# Altium schematic sheet Pixracer_V1_FMU_Alternative_0.SchDoc
size 331 x 293 mm; Origin: Eagle
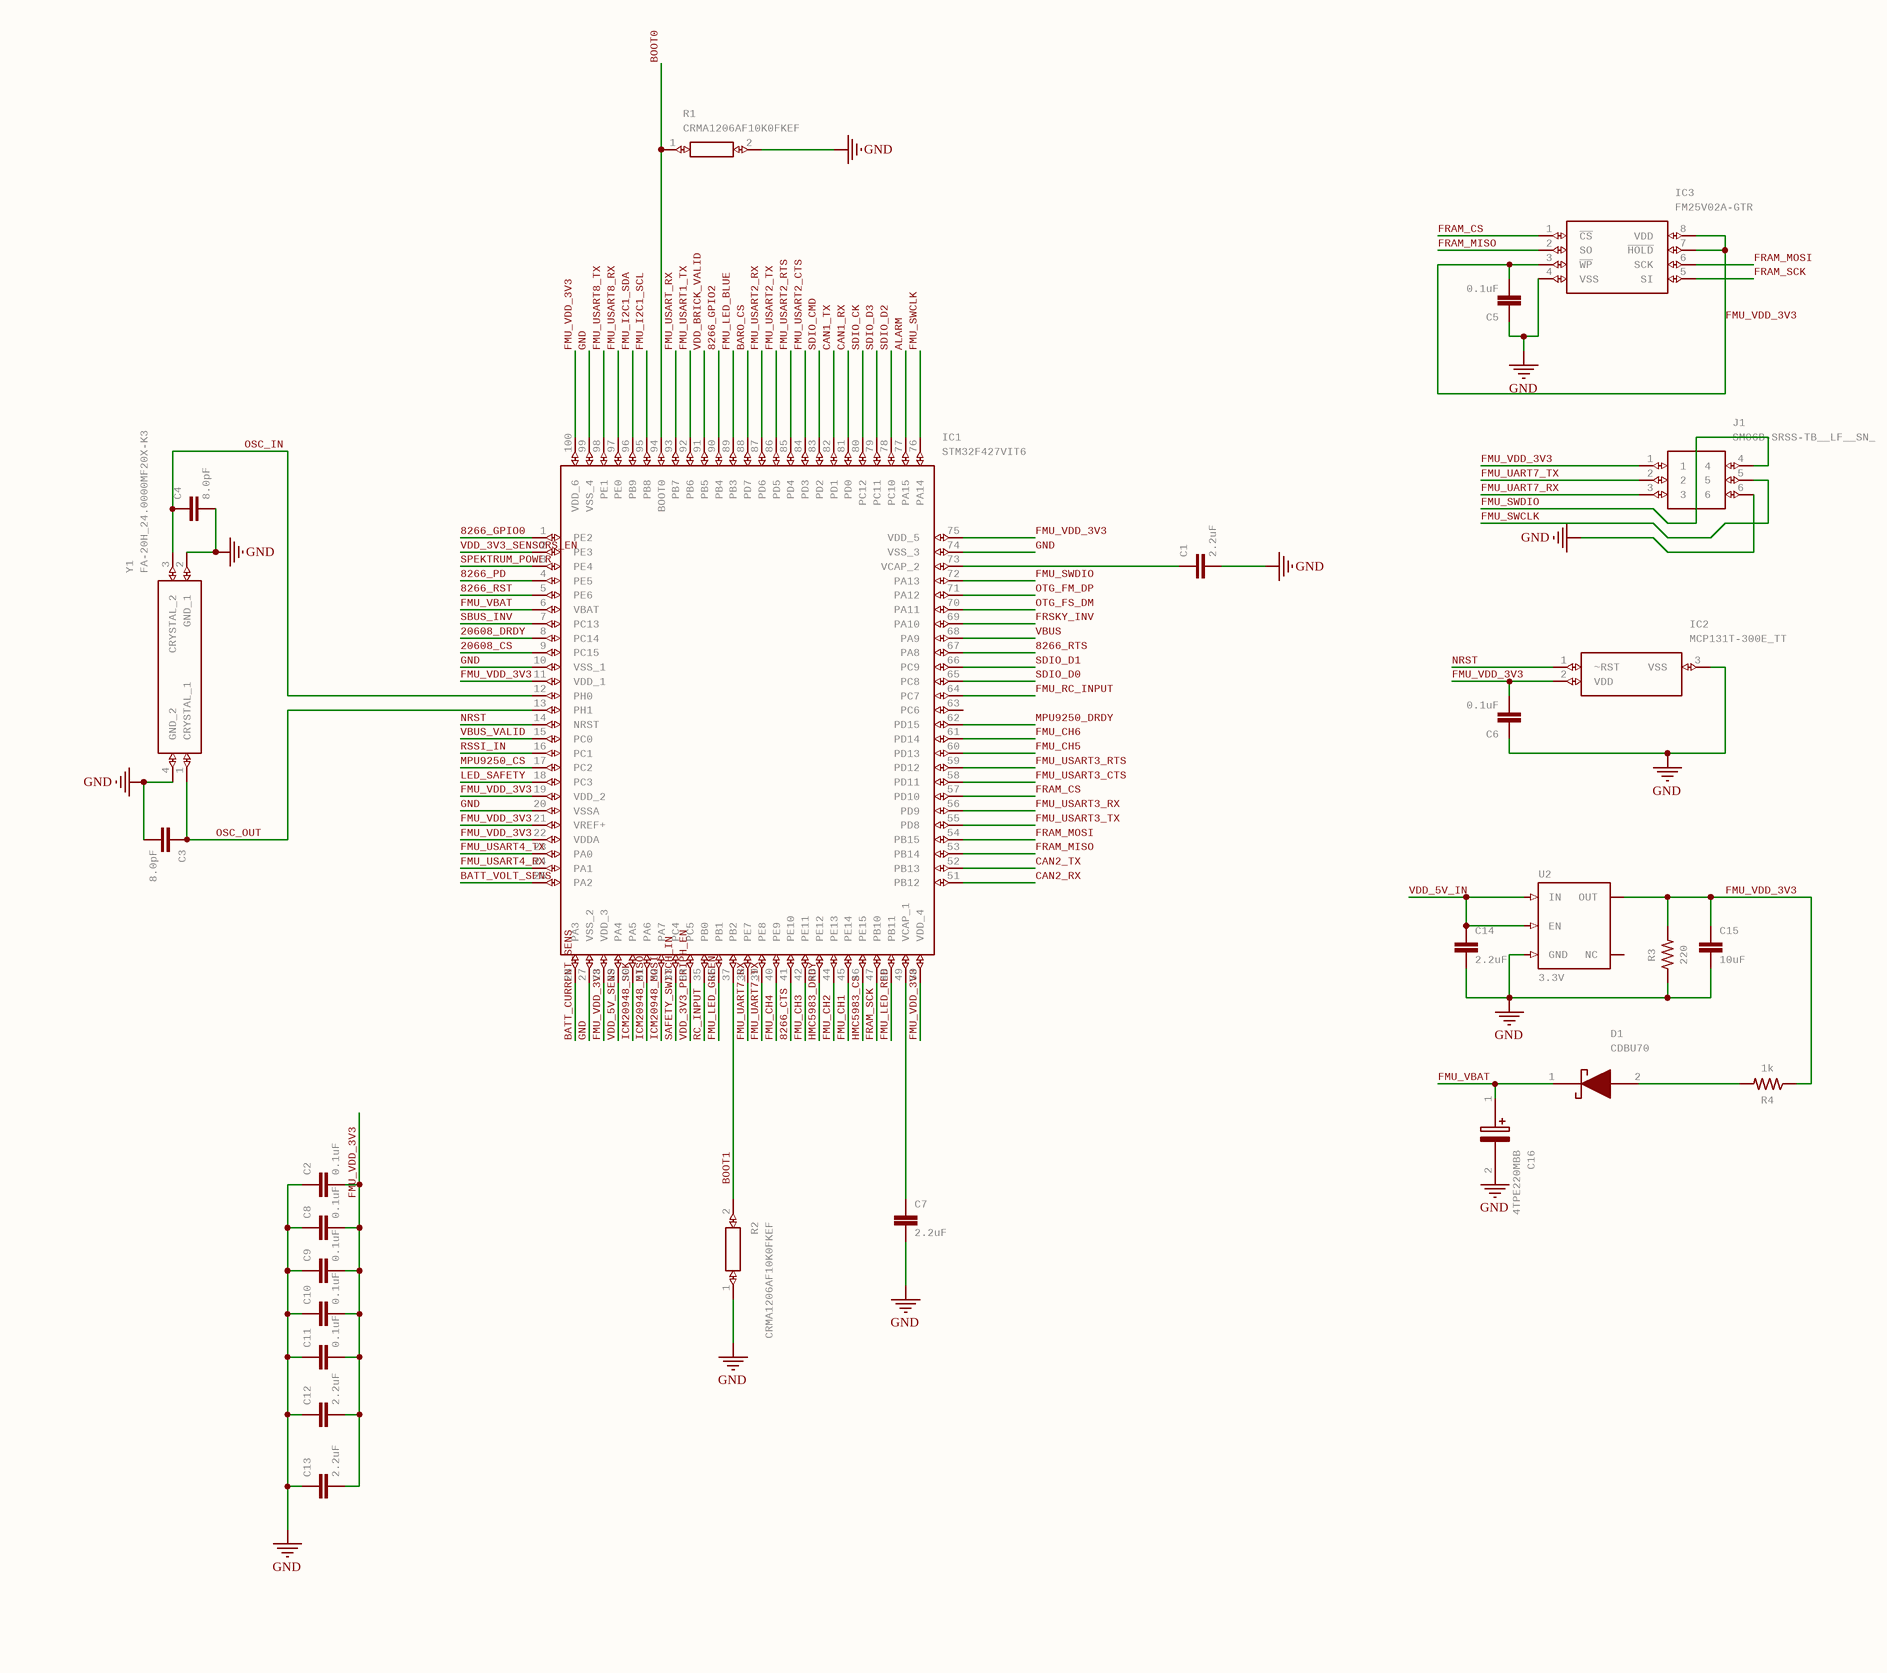
[diagram p0: Pixracer_V1_FMU_Alternative_0.SchDoc]

## Parts
C1  2.2uF  [1206]
C2  0.1uF  [0603]
C3  8.0pF  [0603]
C4  8.0pF  [0603]
C5  0.1uF  [0402]
C6  0.1uF  [0402]
C7  2.2uF  [1206]
C8  0.1uF  [0603]
C9  0.1uF  [0603]
C10  0.1uF  [0603]
C11  0.1uF  [0603]
C12  2.2uF  [1206]
C13  2.2uF  [1206]
C14  2.2uF  [1206]
C15  10uF  [1206]
C16  4TPE220MBB  [4TPE220MBB]
D1  CDBU70  [DIOM179X85N]
IC1  STM32F427VIT6  [QFP50P1600X1600X160-100N]
IC2  MCP131T-300E_TT  [SOT95P237X112-3N]
IC3  FM25V02A-GTR  [SOIC127P602X173-8N]
J1  SM06B-SRSS-TB__LF__SN_  [SM06B-SRSS-TB]
R1  CRMA1206AF10K0FKEF  [RESC3216X74N]
R2  CRMA1206AF10K0FKEF  [RESC3216X74N]
R3  220  [0603]
R4  1k  [0603]
U2  3.3V  [SOT23-5]
Y1  FA-20H_24.0000MF20X-K3  [FA20H160000MF12ZAC3]

## Nets
GND: C1.2 C2.1 C3.2 C4.2 C5.1 C6.1 C7.2 C8.1 C9.1 C10.1 C11.1 C12.1 C13.1 C14.2 C15.2 C16.2(-) IC1.10(VSS_1) IC1.20(VSSA) IC1.27(VSS_2) IC1.74(VSS_3) IC1.99(VSS_4) IC2.3(VSS) IC3.4(VSS) J1.6 R1.2 R2.1 R3.1 U2.2(GND) Y1.2(GND_1) Y1.4(GND_2)
8266_CTS: IC1.41(PE10)
8266_GPIO0: IC1.1(PE2)
8266_GPIO2: IC1.90(PB4)
8266_PD: IC1.4(PE5)
8266_RST: IC1.5(PE6)
8266_RTS: IC1.67(PA8)
20608_CS: IC1.9(PC15)
20608_DRDY: IC1.8(PC14)
ALARM: IC1.77(PA15)
BARO_CS: IC1.88(PD7)
BATT_CURRENT_SENS: IC1.26(PA3)
BATT_VOLT_SENS: IC1.25(PA2)
BOOT0: IC1.94(BOOT0) R1.1
BOOT1: IC1.37(PB2) R2.2
CAN1_RX: IC1.81(PD0)
CAN1_TX: IC1.82(PD1)
CAN2_RX: IC1.51(PB12)
CAN2_TX: IC1.52(PB13)
FMU_CH1: IC1.45(PE14)
FMU_CH2: IC1.44(PE13)
FMU_CH3: IC1.42(PE11)
FMU_CH4: IC1.40(PE9)
FMU_CH5: IC1.60(PD13)
FMU_CH6: IC1.61(PD14)
FMU_I2C1_SCL: IC1.95(PB8)
FMU_I2C1_SDA: IC1.96(PB9)
FMU_LED_BLUE: IC1.89(PB3)
FMU_LED_GREEN: IC1.36(PB1)
FMU_LED_RED: IC1.48(PB11)
FMU_RC_INPUT: IC1.64(PC7)
FMU_SWCLK: IC1.76(PA14) J1.5
FMU_SWDIO: IC1.72(PA13) J1.4
FMU_UART7_RX: IC1.38(PE7) J1.3
FMU_UART7_TX: IC1.39(PE8) J1.2
FMU_USART1_TX: IC1.92(PB6)
FMU_USART2_CTS: IC1.84(PD3)
FMU_USART2_RTS: IC1.85(PD4)
FMU_USART2_RX: IC1.87(PD6)
FMU_USART2_TX: IC1.86(PD5)
FMU_USART3_CTS: IC1.58(PD11)
FMU_USART3_RTS: IC1.59(PD12)
FMU_USART3_RX: IC1.56(PD9)
FMU_USART3_TX: IC1.55(PD8)
FMU_USART4_RX: IC1.24(PA1)
FMU_USART4_TX: IC1.23(PA0)
FMU_USART8_RX: IC1.97(PE0)
FMU_USART8_TX: IC1.98(PE1)
FMU_USART_RX: IC1.93(PB7)
FMU_VBAT: C16.1(+) D1.1(K) IC1.6(VBAT)
FMU_VDD_3V3: C2.2 C5.2 C6.2 C8.2 C9.2 C10.2 C11.2 C12.2 C13.2 C15.1 IC1.11(VDD_1) IC1.19(VDD_2) IC1.21(VREF+) IC1.22(VDDA) IC1.28(VDD_3) IC1.50(VDD_4) IC1.75(VDD_5) IC1.100(VDD_6) IC2.2(VDD) IC3.3(~{WP}) IC3.7(~{HOLD}) IC3.8(VDD) J1.1 R3.2 R4.1 U2.5(OUT)
FRAM_CS: IC1.57(PD10) IC3.1(~{CS})
FRAM_MISO: IC1.53(PB14) IC3.2(SO)
FRAM_MOSI: IC1.54(PB15) IC3.6(SCK)
FRAM_SCK: IC1.47(PB10) IC3.5(SI)
FRSKY_INV: IC1.69(PA10)
HMC5983_CS: IC1.46(PE15)
HMC5983_DRDY: IC1.43(PE12)
ICM20948_MISO: IC1.31(PA6)
ICM20948_MOSI: IC1.32(PA7)
ICM20948_SCK: IC1.30(PA5)
LED_SAFETY: IC1.18(PC3)
MPU9250_CS: IC1.17(PC2)
MPU9250_DRDY: IC1.62(PD15)
NRST: IC1.14(NRST) IC2.1(~RST)
OSC_IN: C4.1 IC1.12(PH0) Y1.3(CRYSTAL_2)
OSC_OUT: C3.1 IC1.13(PH1) Y1.1(CRYSTAL_1)
OTG_FM_DP: IC1.71(PA12)
OTG_FS_DM: IC1.70(PA11)
RC_INPUT: IC1.35(PB0)
RSSI_IN: IC1.16(PC1)
SAFETY_SWITCH_IN: IC1.33(PC4)
SBUS_INV: IC1.7(PC13)
SDIO_CK: IC1.80(PC12)
SDIO_CMD: IC1.83(PD2)
SDIO_D0: IC1.65(PC8)
SDIO_D1: IC1.66(PC9)
SDIO_D2: IC1.78(PC10)
SDIO_D3: IC1.79(PC11)
SPEKTRUM_POWER: IC1.3(PE4)
VBUS: IC1.68(PA9)
VBUS_VALID: IC1.15(PC0)
VDD_3V3_PERIPH_EN: IC1.34(PC5)
VDD_3V3_SENSORS_EN: IC1.2(PE3)
VDD_5V_IN: C14.1 U2.1(IN) U2.3(EN)
VDD_5V_SENS: IC1.29(PA4)
VDD_BRICK_VALID: IC1.91(PB5)
NetC1_1: C1.1 IC1.73(VCAP_2)
NetC7_1: C7.1 IC1.49(VCAP_1)
NetD1_2: D1.2(A) R4.2

Not connected (* = marked no-connect by the designer): IC1 63(PC6); U2 4(NC)

## Library data of the parts
C1 C7 C12-C14 = 2.2UF-1206-50V-10%: 2.2ÂµF ceramic capacitors    A capacitor is a passive two-terminal electrical component used to store electrical energy temporarily in an electric field.; GateName_1: G$1; SymbolName_1: CAP; PROD_ID: CAP-10009; DeviceName: -1206-50V-10%; LibraryName: SparkFun-Capacitors; DeviceSetName: 2.2UF
C2 C8-C11 = 0.1UF-0603-100V-10%-X7R-WE: 0.1ÂµF ceramic capacitors    A capacitor is a passive two-terminal electrical component used to store electrical energy temporarily in an electric field.; GateName_1: G$1; SymbolName_1: CAP; PROD_ID: CAP-16436; DeviceName: -0603-100V-10%-X7R-WE; LibraryName: SparkFun-Capacitors; DeviceSetName: 0.1UF
C3 C4 = 9.0PF-0603-50V-10%: 9.0pF ceramic capacitors    A capacitor is a passive two-terminal electrical component used to store electrical energy temporarily in an electric field.; GateName_1: G$1; SymbolName_1: CAP; PROD_ID: CAP-09341; DeviceName: -0603-50V-10%; LibraryName: SparkFun-Capacitors; DeviceSetName: 9.0PF
C5 C6 = 0.1UF-0402-6.3V-10%-X7R: 0.1ÂµF ceramic capacitors    A capacitor is a passive two-terminal electrical component used to store electrical energy temporarily in an electric field.; GateName_1: G$1; SymbolName_1: CAP; PROD_ID: CAP-14993; DeviceName: -0402-6.3V-10%-X7R; LibraryName: SparkFun-Capacitors; DeviceSetName: 0.1UF
C15 = 10UF-1206-6.3V-20%: 10.0ÂµF ceramic capacitors    A capacitor is a passive two-terminal electrical component used to store electrical energy temporarily in an electric field.; GateName_1: G$1; SymbolName_1: CAP; PROD_ID: CAP-10057; DeviceName: -1206-6.3V-20%; LibraryName: SparkFun-Capacitors; DeviceSetName: 10UF
C16 = 4TPE220MBB: Tantalum Capacitors - Polymer 4VDC 220uF 20% ESR 70mOhm   Source:  Datasheet; MANUFACTURER_NAME: Panasonic; GateName_1: G$1; SymbolName_1: 4TPE220MBB; LibraryName: SamacSys_Parts; DeviceSetName: 4TPE220MBB; HEIGHT: 2mm; MANUFACTURER_PART_NUMBER: 4TPE220MBB; MOUSER_PART_NUMBER: 667-4TPE220MBB; MOUSER_PRICE-STOCK: https://www.mouser.co.uk/ProductDetail/Panasonic/4TPE220MBB?qs=4qgZ1GHix0V27BnmRtQYow%3D%3D
D1 = CDBU70: Schottky Diodes & Rectifiers Schottky Barr Diode 70mA, 70V   Source:  Datasheet; MANUFACTURER_NAME: Comchip Technology; GateName_1: G$1; SymbolName_1: CDBU70; LibraryName: SamacSys_Parts; DeviceSetName: CDBU70; HEIGHT: 0.85mm; MANUFACTURER_PART_NUMBER: CDBU70; MOUSER_PART_NUMBER: 750-CDBU70; MOUSER_PRICE-STOCK: https://www.mouser.co.uk/ProductDetail/Comchip-Technology/CDBU70?qs=J1R1puj4KiHu6WmHr9F3%252Bw%3D%3D
IC1 = STM32F427VIT6: NewSTM32F427VIT6 32bit ARM Cortex M4 MCU, 180MHz, 2048 kB Flash, 256 (System) kB, 4 (Backup) kB RAM, 100-pin LQFP   Source:  Datasheet; MANUFACTURER_NAME: STMicroelectronics; GateName_1: G$1; SymbolName_1: STM32F427VIT6; LibraryName: SamacSys_Parts; DeviceSetName: STM32F427VIT6; HEIGHT: 1.6mm; MANUFACTURER_PART_NUMBER: STM32F427VIT6; MOUSER_PART_NUMBER: 511-STM32F427VIT6; MOUSER_PRICE-STOCK: https://www.mouser.co.uk/ProductDetail/STMicroelectronics/STM32F427VIT6?qs=GlLcxsc1hfFxlQzXIfPRUw%3D%3D
IC2 = MCP131T-300E_TT: Microchip MCP131T-300E/TT, Voltage Supervisor 2.857  3.003 V, 3-Pin SOT-23B   Source:  Datasheet; GateName_1: G$1; SymbolName_1: MCP131T-300E_TT; LibraryName: SamacSys_Parts; DeviceSetName: MCP131T-300E_TT; HEIGHT: mm; MANUFACTURER_NAME: Microchip; MANUFACTURER_PART_NUMBER: MCP131T-300E/TT; MOUSER_PART_NUMBER: 579-MCP131T-300E/TT; MOUSER_PRICE-STOCK: https://www.mouser.com/Search/Refine.aspx?Keyword=579-MCP131T-300E%2FTT
IC3 = FM25V02A-GTR: CYPRESS SEMICONDUCTOR - FM25V02A-GTR - NON-VOL MEMORY, 256KBIT, 40MHZ, SOIC-8   Source:  Datasheet; GateName_1: G$1; SymbolName_1: FM25V02A-GTR; LibraryName: SamacSys_Parts; DeviceSetName: FM25V02A-GTR; HEIGHT: 1.727mm; MANUFACTURER_NAME: Cypress Semiconductor; MANUFACTURER_PART_NUMBER: FM25V02A-GTR; MOUSER_PART_NUMBER: 727-FM25V02A-GTR; MOUSER_PRICE-STOCK: https://www.mouser.co.uk/ProductDetail/Cypress-Semiconductor/FM25V02A-GTR?qs=ILgNtqsyH21Sja70fv%2FiBQ%3D%3D
J1 = SM06B-SRSS-TB__LF__SN_: connector,multipole PCB use,SM06B-SRSS-T JST SH Series, 1mm Pitch 6 Way 1 Row Right Angle PCB Header, Solder Termination, 1A   Source:  Datasheet; MANUFACTURER_NAME: JST (JAPAN SOLDERLESS TERMINALS); MANUFACTURER_PART_NUMBER: SM06B-SRSS-TB (LF)(SN); GateName_1: G$1; SymbolName_1: SM06B-SRSS-TB__LF__SN_; LibraryName: SamacSys_Parts; DeviceSetName: SM06B-SRSS-TB__LF__SN_; HEIGHT: mm; RS_PART_NUMBER: 5468827; RS_PRICE-STOCK: http://uk.rs-online.com/web/p/products/5468827
R1 R2 = CRMA1206AF10K0FKEF: Thick Film Resistors - SMD 0.30W 10Kohm 1% AEC-Q200   Source:  Datasheet; MANUFACTURER_NAME: Vishay; GateName_1: G$1; SymbolName_1: CRMA1206AF10K0FKEF; LibraryName: SamacSys_Parts; DeviceSetName: CRMA1206AF10K0FKEF; HEIGHT: 0.74mm; MANUFACTURER_PART_NUMBER: CRMA1206AF10K0FKEF; MOUSER_PART_NUMBER: 71-CRMA1206AF10K0FKF; MOUSER_PRICE-STOCK: https://www.mouser.co.uk/ProductDetail/Vishay/CRMA1206AF10K0FKEF?qs=TiOZkKH1s2Q81nOs5FD1Wg%3D%3D
R3 = 220OHM-0603-1/10W-1%: 220Î© resistor    A resistor is a passive two-terminal electrical component that implements electrical resistance as a circuit element. Resistors act to reduce current flow, and, at the same time, act to lower voltage levels within circuits. - Wikipedia; GateName_1: G$1; DeviceSetName: 220OHM; PROD_ID: RES-07861; SymbolName_1: RESISTOR; DeviceName: -0603-1/10W-1%; LibraryName: SparkFun-Resistors
R4 = 1KOHM-0603-1/10W-1%: 1kÎ© resistor    A resistor is a passive two-terminal electrical component that implements electrical resistance as a circuit element. Resistors act to reduce current flow, and, at the same time, act to lower voltage levels within circuits. - Wikipedia; GateName_1: G$1; DeviceSetName: 1KOHM; PROD_ID: RES-07856; SymbolName_1: RESISTOR; DeviceName: -0603-1/10W-1%; LibraryName: SparkFun-Resistors
U2 = V_REG_LP5907SOT23-3.0V: LP5907 - 250mA Ultra-Low-Noise LDO Regulator w/ Enable    The LP5907 is a low-noise LDO that can supply up to 250 mA output current. Designed to meet the requirements of RF and analog circuits, the LP5907 device provides low noise, high PSRR, low quiescent current, and low line or load transient response figures. Using new innovative design techniques, the LP5907 offers class-leading noise performance without a noise bypass capacitor and the ability for remote output capacitor placement. The device is designed to work with a 1-ÂµF input and a 1-ÂµF output ceramic capacitor (no separate noise bypass capacitor is required). This device is available with fixed output voltages from 1.2 V to 4.5 V in 25-mV steps.; MANU_PART: LP5907MFX-3.0/NOPB; GateName_1: G$1; SymbolName_1: V-REG-LDO_NO-BP; PROD_ID: VREG-15586; DeviceName: SOT23-3.0V; LibraryName: SparkFun-IC-Power; DeviceSetName: V_REG_LP5907; DIGIKEY_PART: 296-40357-1-ND; MOUSER_PART: 595-LP5907MFX-3.0NPB; PACKAGE: SOT-23(5)
Y1 = FA-20H_24.0000MF20X-K3: Source:  Datasheet; MANUFACTURER_NAME: Epson Timing; MANUFACTURER_PART_NUMBER: FA-20H 24.0000MF20X-K3; GateName_1: G$1; SymbolName_1: FA-20H_24.0000MF20X-K3; LibraryName: SamacSys_Parts; DeviceSetName: FA-20H_24.0000MF20X-K3; HEIGHT: 0.55mm; MOUSER_PART_NUMBER: 732-FA20H-24F20X-K3; MOUSER_PRICE-STOCK: https://www.mouser.co.uk/ProductDetail/Epson-Timing/FA-20H-240000MF20X-K3?qs=CANAagUtPAp2w31393daZQ%3D%3D